# EAGLE design MX25U6435F_eval_0 (EAGLE 7.7.0)
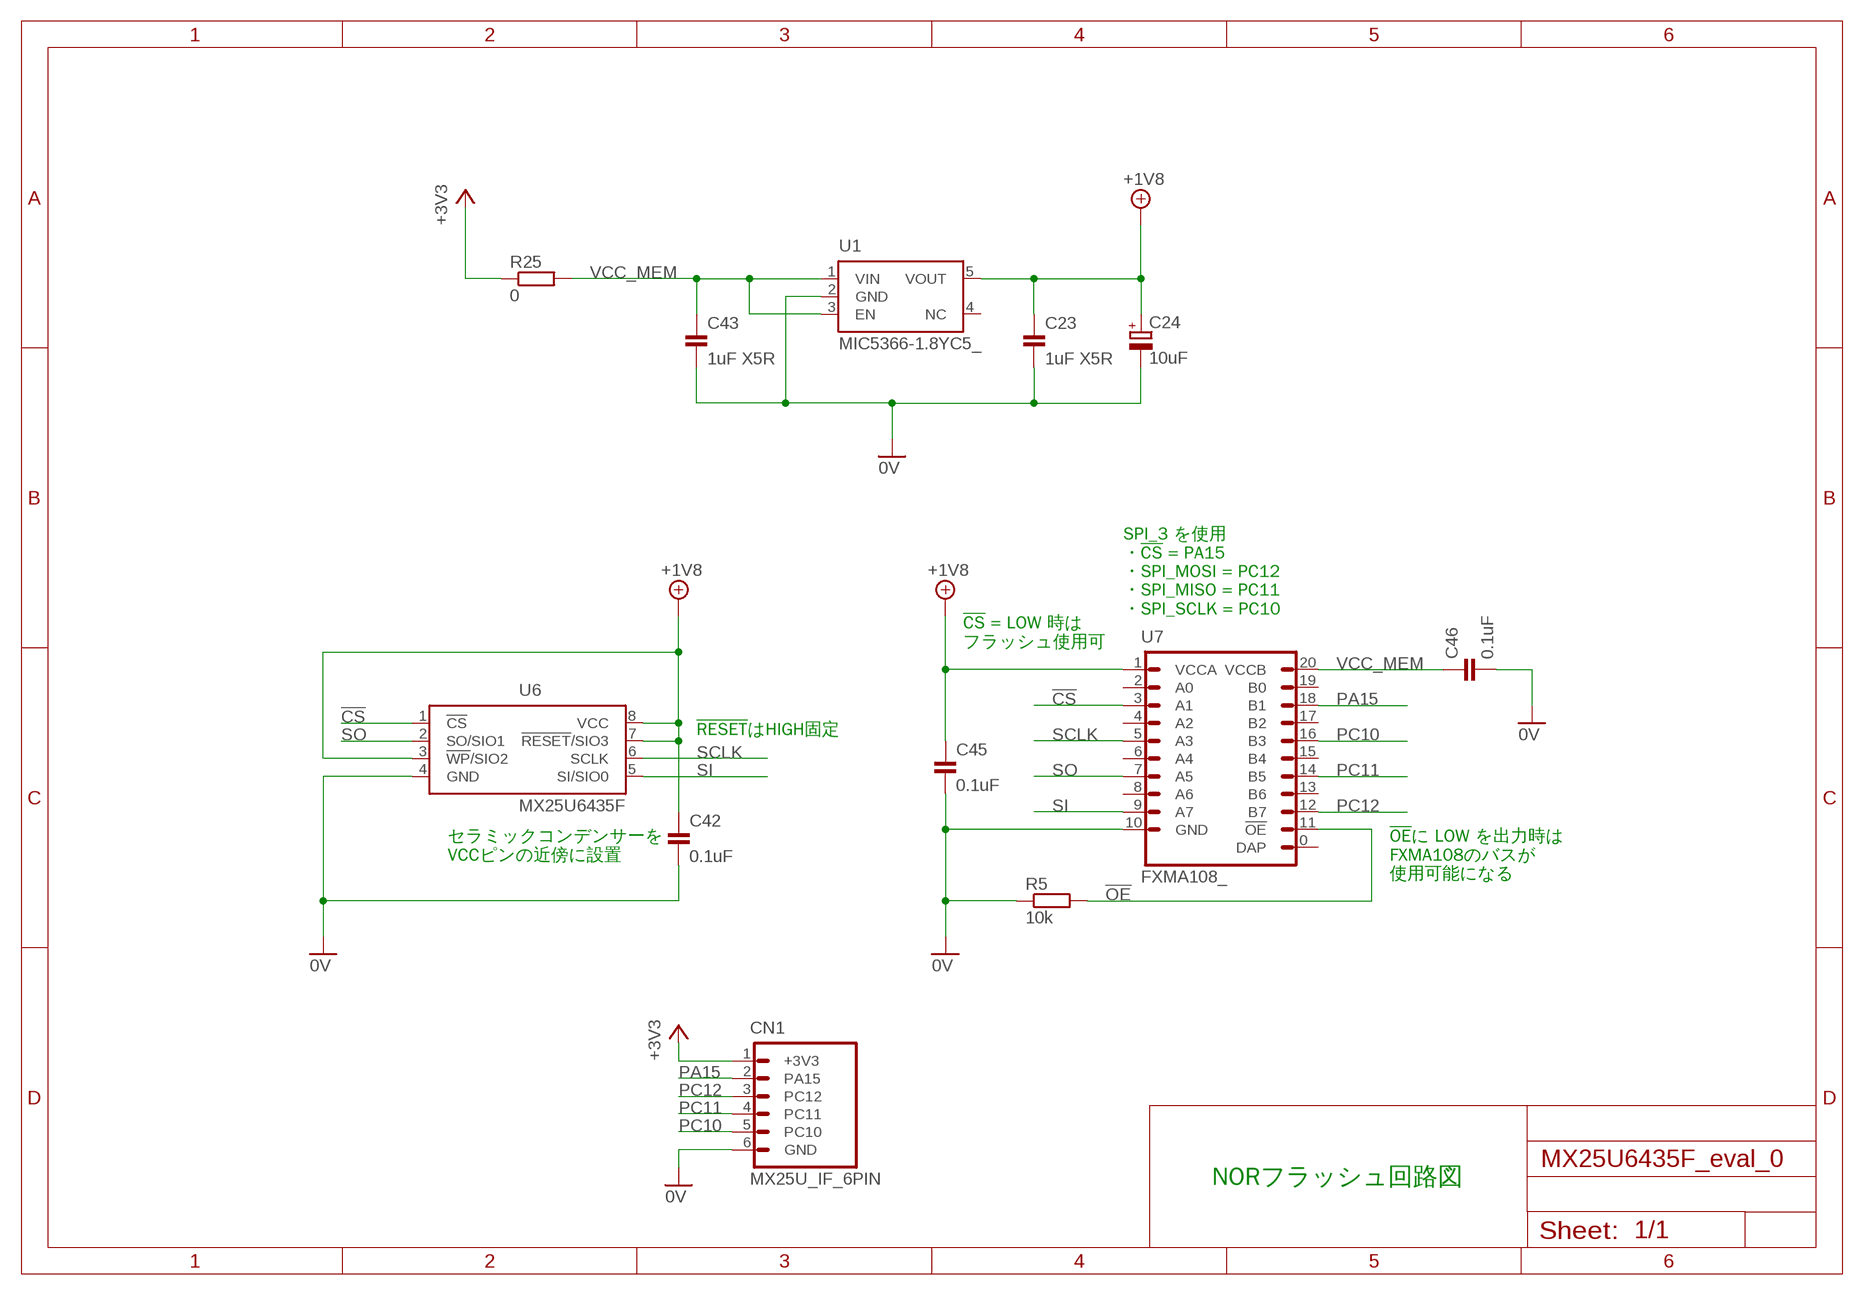
[diagram p0: schematic, sheet 1]

## Parts
C23  1uF X5R  CAP_0603_DEV  [SMD_1608_DEV]
C24  10uF  TPST106K016R0800_  [C1210_TPST_DEV]
C42  0.1uF  CAP_0603_DEV  [SMD_1608_DEV]
C43  1uF X5R  CAP_0603_DEV  [SMD_1608_DEV]
C45  0.1uF  CAP_0603_DEV  [SMD_1608_DEV]
C46  0.1uF  CAP_0603_DEV  [SMD_1608_DEV]
CN1  MX25U_IF_6PIN  [HEADER_6PIN]
R5  10k  RESISTOR_0603_DEV  [SMD_1608_DEV]
R25  0  RESISTOR_0603_DEV  [SMD_1608_DEV]
U1  MIC5366-1.8YC5_  [SC-70-5_DEV]
U6  MX25U6435F  [SO8]
U7  FXMA108_  [DQFN20_DEV]

## Nets
0V: C23.2 C24.2(-) C42.2 C43.2 C45.2 C46.2 CN1.6(GND) R5.1 U1.2(GND) U6.4(GND) U7.10(GND)
!CS!: U6.1(!CS) U7.3(A1)
!OE!: R5.2 U7.11(!OE!)
+1V8: C23.1 C24.1(+) C42.1 C45.1 U1.5(VOUT) U6.3(!WP!/SIO2) U6.7(!RESET!/SIO3) U6.8(VCC) U7.1(VCCA)
+3V3: CN1.1(+3V3) R25.1
PA15: CN1.2(PA15) U7.18(B1)
PC10: CN1.5(PC10) U7.16(B3)
PC11: CN1.4(PC11) U7.14(B5)
PC12: CN1.3(PC12) U7.12(B7)
SCLK: U6.6(SCLK) U7.5(A3)
SI: U6.5(SI/SIO0) U7.9(A7)
SO: U6.2(SO/SIO1) U7.7(A5)
VCC_MEM: C43.1 C46.1 R25.2 U1.1(VIN) U1.3(EN) U7.20(VCCB)
Unconnected: U1.4(NC) U7.0(DAP) U7.2(A0) U7.4(A2) U7.6(A4) U7.8(A6) U7.13(B6) U7.15(B4) U7.17(B2) U7.19(B0)

## Notes on the sheet
- SPI_3 を使用
  ・!CS! = PA15
  ・SPI_MOSI = PC12
  ・SPI_MISO = PC11
  ・SPI_SCLK = PC10
- !CS! = LOW 時は
  フラッシュ使用可
- !RESET!はHIGH固定
- セラミックコンデンサーを
  VCCピンの近傍に設置
- !OE!に LOW を出力時は
  FXMA108のバスが
  使用可能になる
- NORフラッシュ回路図

## Library data of the parts
C23 C42 C43 C45 C46 = Parts:CAP: コンデンサー
C24 = Parts:TPST*: タンタルコンデンサ TPST106K016R0800 10µF ±10% 16V ESR（等価直列抵抗）: 0.8オーム 動作温度 : -55°C～125°C サイズ : 3.50mm x 2.80mm
CN1 = PartsForProto:MX25U_IF_6PIN: MX25U6435F評価用インターフェース
R5 R25 = Parts:RESISTOR: 抵抗器
U1 = Parts:MIC5366: LDO電圧レギュレータ 出力電圧: 1.8 V 出力電流: 150 mA 入力電圧最大値: 5.5 V 最低動作温度: - 40 C 最高動作温度: + 125 C ドロップアウト電圧 - 最大: 380 mV
U6 = Parts:MX25U6435F: 1.8V 64M-BIT FLASH MEMORY
U7 = Parts:FXMA108: ２電源双方向レベル変換IC 電源電圧:1.65V~5.5V (絶対最大定格:7.0V)

## Board
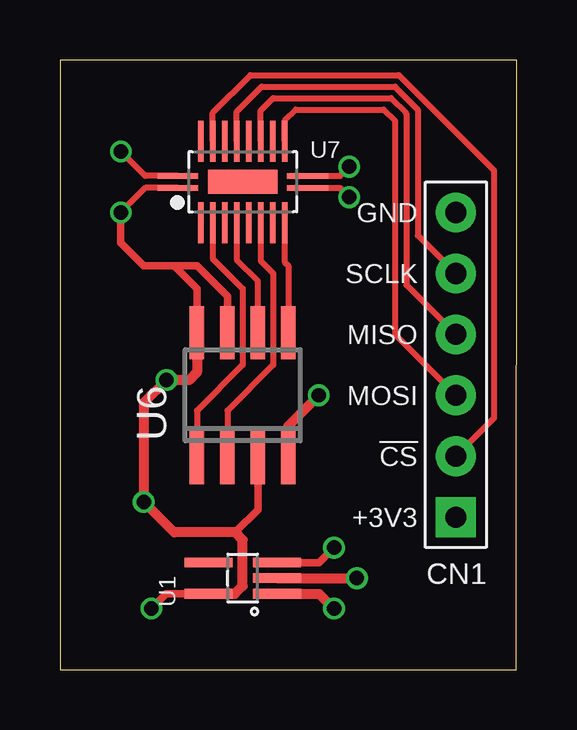
[diagram p1: board, top side]
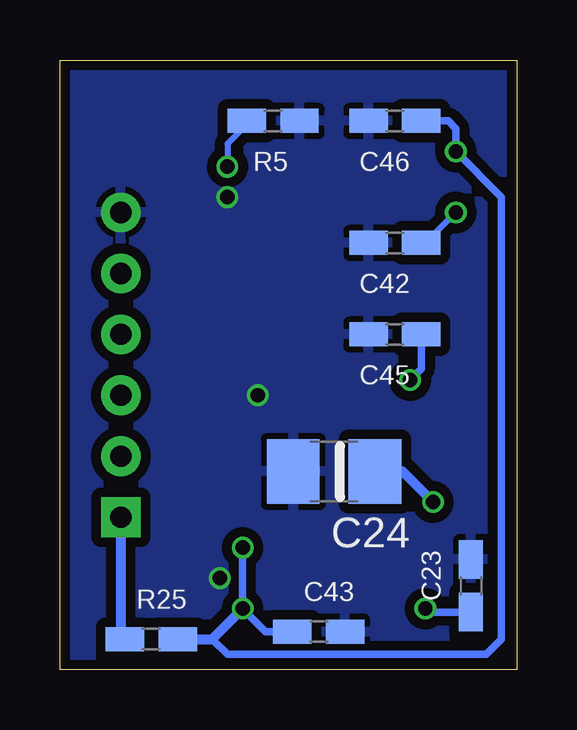
[diagram p2: board, bottom side, seen from below]

Size 19.05 x 25.4 mm. Coordinates in mm from the lower left corner, seen from the top.
Outline: 0,0 19.03,0 19.05,25.4 0,25.4 0,0
Copper layers (1*16): Top 0.035mm / dielectric 1.5mm / Bottom 0.035mm
Design rules "SeeedStudio_2layer_DRU_no_angle_20140221": minimum track width 6mil, minimum drill 12mil, track to track 6mil, track to pad 6mil, pad to pad 6mil, via to via 6mil, smd to smd 0mil, copper to edge 10mil, drill to drill 10mil, minimum pad ring 10mil, minimum via ring 6mil, stop-mask expansion 2mil, vias tented up to drill 100mil, thermal gap 10mil

### Footprints (pad centres in the part's own frame; a part is rotated, then mirrored left to right if it is on the bottom)
SMD_1608_DEV = smd 1.6 x 1: 1 -1.1,0; 2 1.1,0
C1210_TPST_DEV = smd 2.2 x 2.7: 1 -1.7,0; 2 1.7,0
HEADER_6PIN = drill 0.889 pad 1.651 square: 1 0,0 | drill 0.889 pad 1.651: 2 2.54,0; 3 5.08,0; 4 7.62,0; 5 10.16,0; 6 12.7,0
SC-70-5_DEV = smd 0.4 x 2: 1 -0.65,-1.425; 2 0,-1.425; 3 0.65,-1.425; 4 0.65,1.425; 5 -0.65,1.425
SO8 = smd 0.6 x 2.2: 1 -1.905,-2.6; 2 -0.635,-2.6; 3 0.635,-2.6; 4 1.905,-2.6; 5 1.905,2.6; 6 0.635,2.6; 7 -0.635,2.6; 8 -1.905,2.6
DQFN20_DEV = smd 2.9 x 1: 0 0,0 | smd 1.7 x 0.24: 1 -2.7,-0.25; 10 2.7,-0.25; 11 2.7,0.25; 20 -2.7,0.25 | smd 0.24 x 1.7: 2 -1.75,-1.7; 3 -1.25,-1.7; 4 -0.75,-1.7; 5 -0.25,-1.7; 6 0.25,-1.7; 7 0.75,-1.7; 8 1.25,-1.7; 9 1.75,-1.7; 12 1.75,1.7; 13 1.25,1.7; 14 0.75,1.7; 15 0.25,1.7; 16 -0.25,1.7; 17 -0.75,1.7; 18 -1.25,1.7; 19 -1.75,1.7

### Placement (x,y rotation side)
C23  1.91,3.49 90 bottom
C24  7.62,8.26 180 bottom
C42  5.08,17.78 180 bottom
C43  8.26,1.59 0 bottom
C45  5.08,13.97 180 bottom
C46  5.08,22.86 180 bottom
CN1  16.51,6.35 90 top
R5  10.16,22.86 180 bottom
R25  15.24,1.27 0 bottom
U1  7.62,3.81 90 top
U6  7.62,11.43 0 top
U7  7.62,20.32 0 top

### Tracks (layer width: path | path; a pad name or v marks a point on that pad's centre or on a via)
0V  (via drill 0.6)
  Top 0.254: U7.10 11.68,20.07 v12.06,19.68
  Top 0.406: U1.2 v12.38,3.81 | U6.4 9.53,10.16 v10.79,11.43
  pour Bottom (isolate 0.406): -1.27,26.67 20.32,26.67 20.32,-1.27 -1.27,-1.27
!CS!
  Top 0.254: U7.3 6.37,17.12 7.62,15.88 7.62,12.7 5.71,10.79 U6.1
!OE!  (via drill 0.6)
  Top 0.254: U7.11 11.68,20.57 v12.06,20.95
  Bottom 0.254: R5.2 11.26,22.71 12.06,21.91 v12.06,20.95
+1V8  (via drill 0.6)
  Top 0.254: U7.1 3.56,20.07 v2.54,19.05
  Top 0.305: U1.5 4.43,3.16 v3.81,2.54 | U6.8 5.71,15.88 4.76,16.83 | U6.7 6.99,15.56 5.71,16.83 4.76,16.83 | U6.3 8.26,6.67 7.3,5.71 | 4.76,16.83 3.49,16.83 2.54,17.78 v2.54,19.05
  Top 0.406: U1.5 7.29,3.16 7.62,3.49 7.62,5.4 7.3,5.71 4.76,5.71 v3.49,6.99 3.49,11.11 v4.45,12.06 5.4,12.06 5.71,12.38 U6.8
  Bottom 0.254: C42.1 3.81,17.78 v2.54,19.05
  Bottom 0.305: C23.1 3.66,2.39 v3.81,2.54 | C45.1 3.98,12.53 v4.45,12.06
  Bottom 0.406: v3.49,6.99 4.76,8.26 C24.1
+3V3
  Bottom 0.406: CN1.1 16.51,1.44 R25.1
PA15
  Top 0.254: CN1.2 18.1,10.48 18.1,20.8 14.13,24.77 7.94,24.77 6.37,23.2 U7.18
PC10
  Top 0.254: CN1.5 14.92,18.1 14.92,23.34 13.97,24.29 8.41,24.29 7.37,23.25 U7.16
PC11
  Top 0.254: U7.14 8.37,23.29 8.89,23.81 13.81,23.81 14.45,23.18 14.45,16.03 CN1.4
PC12
  Top 0.254: U7.12 9.37,22.86 9.84,23.34 13.49,23.34 13.97,22.86 13.97,13.97 CN1.3
SCLK
  Top 0.254: U6.6 8.26,16.19 7.37,17.08 U7.5
SI
  Top 0.254: U7.9 9.37,16.98 9.53,16.83 U6.5
SO
  Top 0.254: U7.7 8.37,17.03 8.89,16.51 8.89,12.7 6.99,10.79 U6.2
VCC_MEM  (via drill 0.6)
  Top 0.254: U7.20 3.56,20.57 v2.54,21.59
  Top 0.305: U1.3 10.81,4.46 v11.43,5.08
  Top 0.406: U1.1 10.81,3.16 v11.43,2.54
  Bottom 0.305: 12.7,1.27 12.06,0.64 1.27,0.64 0.64,1.27 0.64,19.68 v2.54,21.59 2.54,22.54 2.86,22.86 C46.1 | C43.1 10.48,1.59 v11.43,2.54 v11.43,5.08
  Bottom 0.406: v11.43,2.54 12.7,1.27 R25.2

### Text on the board
tPlace: GND | SCLK | MISO | MOSI | !CS! | +3V3